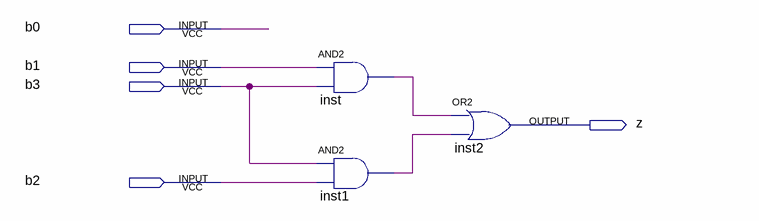
[diagram p0: schematic sheet]
// Quartus schematic komparator.bdf as structural Verilog: 3 symbols, 5 pins
module komparator (
  input  b0,
  input  b1,
  input  b3,
  input  b2,
  output z
);

  wire inst1_out, inst_out;

  and inst (inst_out, b1, b3);
  and inst1 (inst1_out, b3, b2);
  or inst2 (z, inst_out, inst1_out);
endmodule
